# EAGLE design ver9 (EAGLE 6.4)
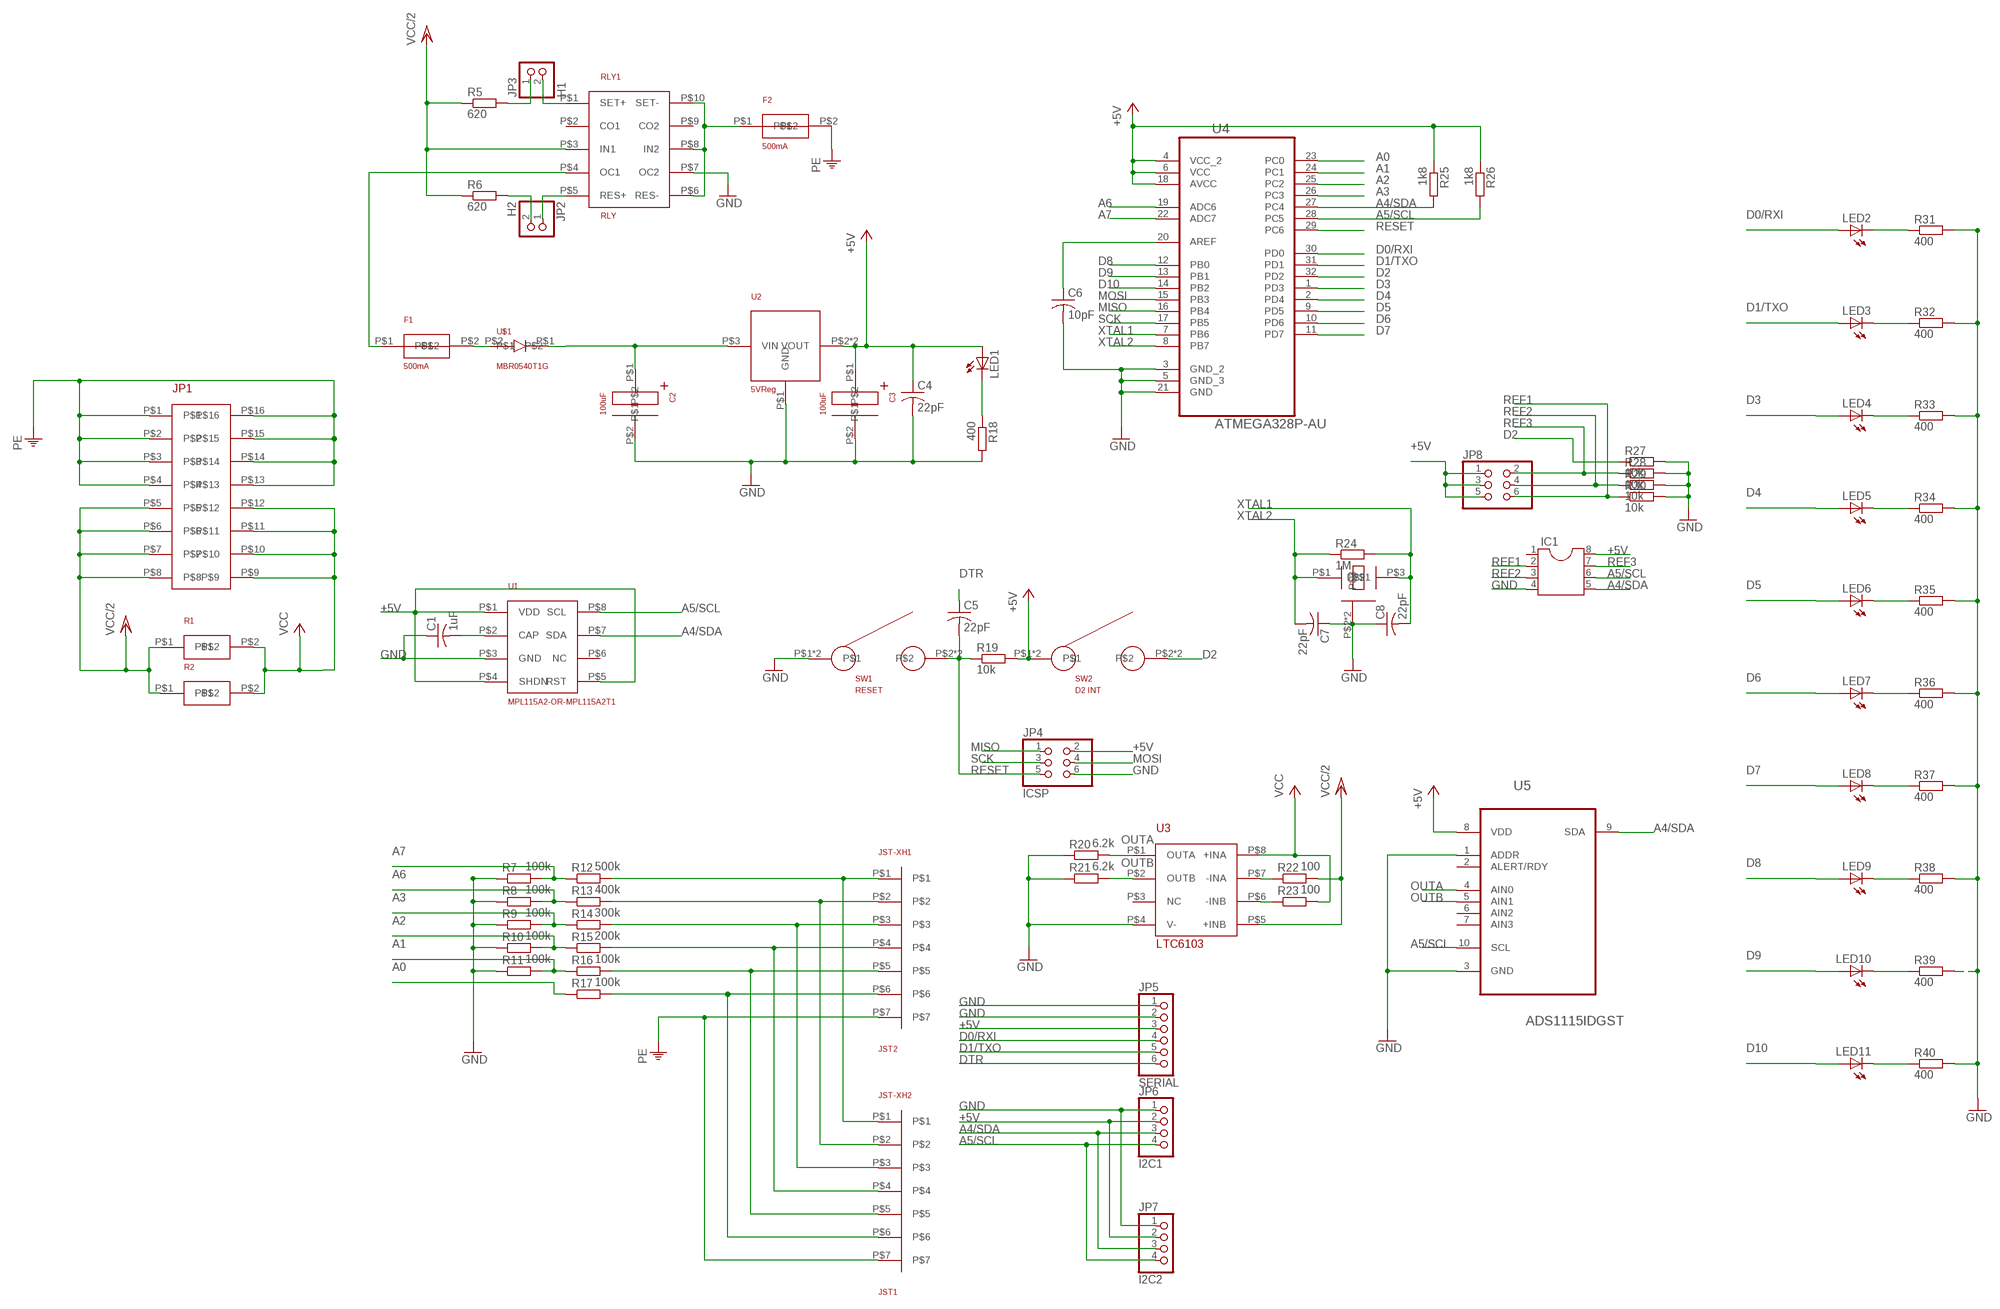
[diagram p0: schematic, sheet 1]

## Parts
C1  1uF  C-USC1206  [C1206]
C2  100uF  EEEFTH101XAP  [EEEFTH101XAP]
C3  100uF  EEEFTH101XAP  [EEEFTH101XAP]
C4  22pF  C-USC1206  [C1206]
C5  22pF  C-USC1206  [C1206]
C6  10pF  C-USC1206  [C1206]
C7  22pF  C-USC1206  [C1206]
C8  22pF  C-USC1206  [C1206]
F1  500mA  MF-MSMF050-2  [MF-MSMF050-2]
F2  500mA  0154.500DR-FUSE-0453.500  [0154.500DR-FUSE-0453.500]
IC1  DIL8S  [SOCKET-08]
JP1  39-29-1167-MOLEX  [39-29-1167-MOLEX]
JP2  H2  PINHD-1X2  [1X02]
JP3  H1  PINHD-1X2  [1X02]
JP4  ICSP  PINHD-2X3  [2X03]
JP5  SERIAL  PINHD-1X6  [1X06]
JP6  I2C1  PINHD-1X4  [1X04]
JP7  I2C2  PINHD-1X4  [1X04]
JP8  PINHD-2X3  [2X03]
JST-XH1  JST2  JSTXH-7PIN  [JSTXH-7PIN]
JST-XH2  JST1  JSTXH-7PIN  [JSTXH-7PIN]
LED1  LED1206  [LED-1206]
LED2  LED1206  [LED-1206]
LED3  LED1206  [LED-1206]
LED4  LED1206  [LED-1206]
LED5  LED1206  [LED-1206]
LED6  LED1206  [LED-1206]
LED7  LED1206  [LED-1206]
LED8  LED1206  [LED-1206]
LED9  LED1206  [LED-1206]
LED10  LED1206  [LED-1206]
LED11  LED1206  [LED-1206]
R1  OARSXPR002FLF  [OARSXPR002FLF]
R2  OARSXPR002FLF  [OARSXPR002FLF]
R5  620  R-EU_R1206  [R1206]
R6  620  R-EU_R1206  [R1206]
R7  100k  R-EU_R1206  [R1206]
R8  100k  R-EU_R1206  [R1206]
R9  100k  R-EU_R1206  [R1206]
R10  100k  R-EU_R1206  [R1206]
R11  100k  R-EU_R1206  [R1206]
R12  500k  R-EU_R1206  [R1206]
R13  400k  R-EU_R1206  [R1206]
R14  300k  R-EU_R1206  [R1206]
R15  200k  R-EU_R1206  [R1206]
R16  100k  R-EU_R1206  [R1206]
R17  100k  R-EU_R1206  [R1206]
R18  400  R-EU_R1206  [R1206]
R19  10k  R-EU_R1206  [R1206]
R20  6.2k  R-EU_R1206  [R1206]
R21  6.2k  R-EU_R1206  [R1206]
R22  100  R-EU_R1206  [R1206]
R23  100  R-EU_R1206  [R1206]
R24  1M  R-EU_R1206  [R1206]
R25  1k8  R-EU_R1206  [R1206]
R26  1k8  R-EU_R1206  [R1206]
R27  10k  R-EU_R1206  [R1206]
R28  10k  R-EU_R1206  [R1206]
R29  10k  R-EU_R1206  [R1206]
R30  10k  R-EU_R1206  [R1206]
R31  400  R-EU_R1206  [R1206]
R32  400  R-EU_R1206  [R1206]
R33  400  R-EU_R1206  [R1206]
R34  400  R-EU_R1206  [R1206]
R35  400  R-EU_R1206  [R1206]
R36  400  R-EU_R1206  [R1206]
R37  400  R-EU_R1206  [R1206]
R38  400  R-EU_R1206  [R1206]
R39  400  R-EU_R1206  [R1206]
R40  400  R-EU_R1206  [R1206]
RLY1  RLY  3-1393788-3  [3-1393788-3]
SW1  RESET  MC32829  [MC32829]
SW2  D2 INT  MC32829  [MC32829]
U1  MPL115A2-OR-MPL115A2T1  [MPL115A2-OR-MPL115A2T1]
U2  5VReg  NX1117C50Z  [NX1117C50Z]
U3  LTC6103  LTC6103CMS8#PBF  [LTC6103CMS8#PBF]
U4  ATMEGA328P-AU  [QFP80P900X900X120-32N]
U5  ADS1115IDGST  [SOP50P490X110-10N]
U$1  MBR0540T1G  [MBR0540T1G]
XT1  ABMM2-16.000MHZ-E2-T  [ABMM2-16.000MHZ-E2-T]

## Nets
+5V: C3.P$1 C4.1 IC1.8 JP4.2 JP5.3 JP6.2 JP7.2 JP8.1 JP8.3 JP8.5 LED1.A R19.2 R25.1 R26.1 SW2.P$1 SW2.P$4 U1.P$1(VDD) U1.P$4(SHDN) U1.P$5(RST) U2.P$2(VOUT) U2.P$4(VOUT) U4.4(VCC_2) U4.6(VCC) U4.18(AVCC) U5.8(VDD)
A0: R17.1 U4.23(PC0)
A1: R11.2 R16.1 U4.24(PC1)
A2: R10.2 R15.1 U4.25(PC2)
A3: R9.2 R14.1 U4.26(PC3)
A4/SDA: IC1.5 JP6.3 JP7.3 R25.2 U1.P$7(SDA) U4.27(PC4) U5.9(SDA)
A5/SCL: IC1.6 JP6.4 JP7.4 R26.2 U1.P$8(SCL) U4.28(PC5) U5.10(SCL)
A6: R8.2 R13.1 U4.19(ADC6)
A7: R7.2 R12.1 U4.22(ADC7)
D0/RXI: JP5.4 LED2.A U4.30(PD0)
D1/TXO: JP5.5 LED3.A U4.31(PD1)
D2: R27.1 SW2.P$2 SW2.P$3 U4.32(PD2)
D3: LED4.A U4.1(PD3)
D4: LED5.A U4.2(PD4)
D5: LED6.A U4.9(PD5)
D6: LED7.A U4.10(PD6)
D7: LED8.A U4.11(PD7)
D8: LED9.A U4.12(PB0)
D9: LED10.A U4.13(PB1)
D10: LED11.A U4.14(PB2)
DTR: C5.1 JP5.6
GND: C1.1 C2.P$2 C3.P$2 C4.2 C6.2 C7.1 C8.1 IC1.4 JP4.6 JP5.1 JP5.2 JP6.1 JP7.1 R7.1 R8.1 R9.1 R10.1 R11.1 R18.2 R20.1 R21.1 R27.2 R28.2 R29.2 R30.2 R31.2 R32.2 R33.2 R34.2 R35.2 R36.2 R37.2 R38.2 R39.2 R40.2 RLY1.P$7(OC2) SW1.P$1 SW1.P$4 U1.P$3(GND) U2.P$1(GND) U3.P$4(V-) U4.3(GND_2) U4.5(GND_3) U4.21(GND) U5.1(ADDR) U5.3(GND) XT1.P$2 XT1.P$4
MISO: JP4.1 U4.16(PB4)
MOSI: JP4.4 U4.15(PB3)
N$1: F1.P$1 RLY1.P$4(OC1)
N$2: C2.P$1 U2.P$3(VIN) U$1.P$1
N$3: F1.P$2 U$1.P$2
N$4: LED1.C R18.1
N$5: JP3.1 R5.2
N$6: JP3.2 RLY1.P$1(SET+)
N$7: LED2.C R31.1
N$9: LED3.C R32.1
N$10: LED4.C R33.1
N$11: LED5.C R34.1
N$12: LED6.C R35.1
N$13: LED7.C R36.1
N$14: LED8.C R37.1
N$15: LED9.C R38.1
N$16: LED10.C R39.1
N$17: LED11.C R40.1
N$18: JST-XH1.P$1 JST-XH2.P$1 R12.2
N$19: JST-XH1.P$2 JST-XH2.P$2 R13.2
N$20: JST-XH1.P$3 JST-XH2.P$3 R14.2
N$21: JST-XH1.P$4 JST-XH2.P$4 R15.2
N$22: JST-XH1.P$5 JST-XH2.P$5 R16.2
N$23: JST-XH1.P$6 JST-XH2.P$6 R17.2
N$24: JP2.2 R6.2
N$25: C6.1 U4.20(AREF)
N$26: F2.P$1 RLY1.P$6(RES-) RLY1.P$8(IN2) RLY1.P$10(SET-)
N$27: JP2.1 RLY1.P$5(RES+)
N$29: R22.1 U3.P$7(-INA)
N$30: R23.1 U3.P$6(-INB)
N$32: C1.2 U1.P$2(CAP)
OUTA: R20.2 U3.P$1(OUTA) U5.4(AIN0)
OUTB: R21.2 U3.P$2(OUTB) U5.5(AIN1)
PE: F2.P$2 JP1.P$1 JP1.P$2 JP1.P$3 JP1.P$4 JP1.P$13 JP1.P$14 JP1.P$15 JP1.P$16 JST-XH1.P$7 JST-XH2.P$7
REF1: IC1.2 JP8.6 R30.1
REF2: IC1.3 JP8.4 R29.1
REF3: IC1.7 JP8.2 R28.1
RESET: C5.2 JP4.5 R19.1 SW1.P$2 SW1.P$3 U4.29(PC6)
SCK: JP4.3 U4.17(PB5)
VCC: JP1.P$9 JP1.P$10 JP1.P$11 JP1.P$12 R1.P$2 R2.P$2 R23.2 U3.P$8(+INA)
VCC/2: JP1.P$5 JP1.P$6 JP1.P$7 JP1.P$8 R1.P$1 R2.P$1 R5.1 R6.1 R22.2 RLY1.P$3(IN1) U3.P$5(+INB)
XTAL1: C8.2 R24.2 U4.7(PB6) XT1.P$3
XTAL2: C7.2 R24.1 U4.8(PB7) XT1.P$1
Unconnected: IC1.1 RLY1.P$2(CO1) RLY1.P$9(CO2) U1.P$6(NC) U3.P$3(NC) U5.2(ALERT/RDY) U5.6(AIN2) U5.7(AIN3)

## Library data of the parts
C1 C4-C8 = resistor:C-US: CAPACITOR, American symbol
C2 C3 = ver5:EEEFTH101XAP
F1 = ver4:MF-MSMF050-2
F2 = ver5:0154.500DR-FUSE-0453.500
IC1 = ic-package:DIL8: Dual In Line / Socket
JP1 = ver4:39-29-1167-MOLEX
JP2 JP3 = pinhead:PINHD-1X2: PIN HEADER
JP4 JP8 = pinhead:PINHD-2X3: PIN HEADER
JP5 = pinhead:PINHD-1X6: PIN HEADER
JP6 JP7 = pinhead:PINHD-1X4: PIN HEADER
JST-XH1 JST-XH2 = ver4:JSTXH-7PIN: Just a 7 Pin connector for JST Purposes
LED1-LED11 = SparkFun-LED:LED: LEDs Standard schematic elements and footprints for 5mm, 3mm, 1206, and 0603 sized LEDs. 5mm - Spark Fun Electronics SKU : COM-00529 (and others)
R1 R2 = ver5:OARSXPR002FLF
R5-R40 = resistor:R-EU_: RESISTOR, European symbol
RLY1 = ver4:3-1393788-3
SW1 SW2 = ver4:MC32829
U1 = ver5:MPL115A2-OR-MPL115A2T1
U2 = ver4:NX1117C50Z
U3 = ver4:LTC6103CMS8#PBF
U4 = Atmel_By_element14_Batch_1:ATMEGA328P-AU: 8-bit Microcontroller with In-System Programmable Flash; MPN: ATMEGA328P-AU; OC_FARNELL: 1715486; OC_NEWARK: 14R4631; PACKAGE: TQFP-32; SUPPLIER: Atmel
U5 = bbauv:ADS1115IDGST: Analog-to-Digital Converter with Internal Reference; MPN: ADS1115IDGST; OC_FARNELL: 1762981; OC_NEWARK: 25R1241; PACKAGE: MSOP-10; SUPPLIER: Texas Instruments
U$1 = ver4:MBR0540T1G
XT1 = ver5:ABMM2-16.000MHZ-E2-T

## Net classes
0 default: width 0.254 mm, clearance 0.508 mm

## Board
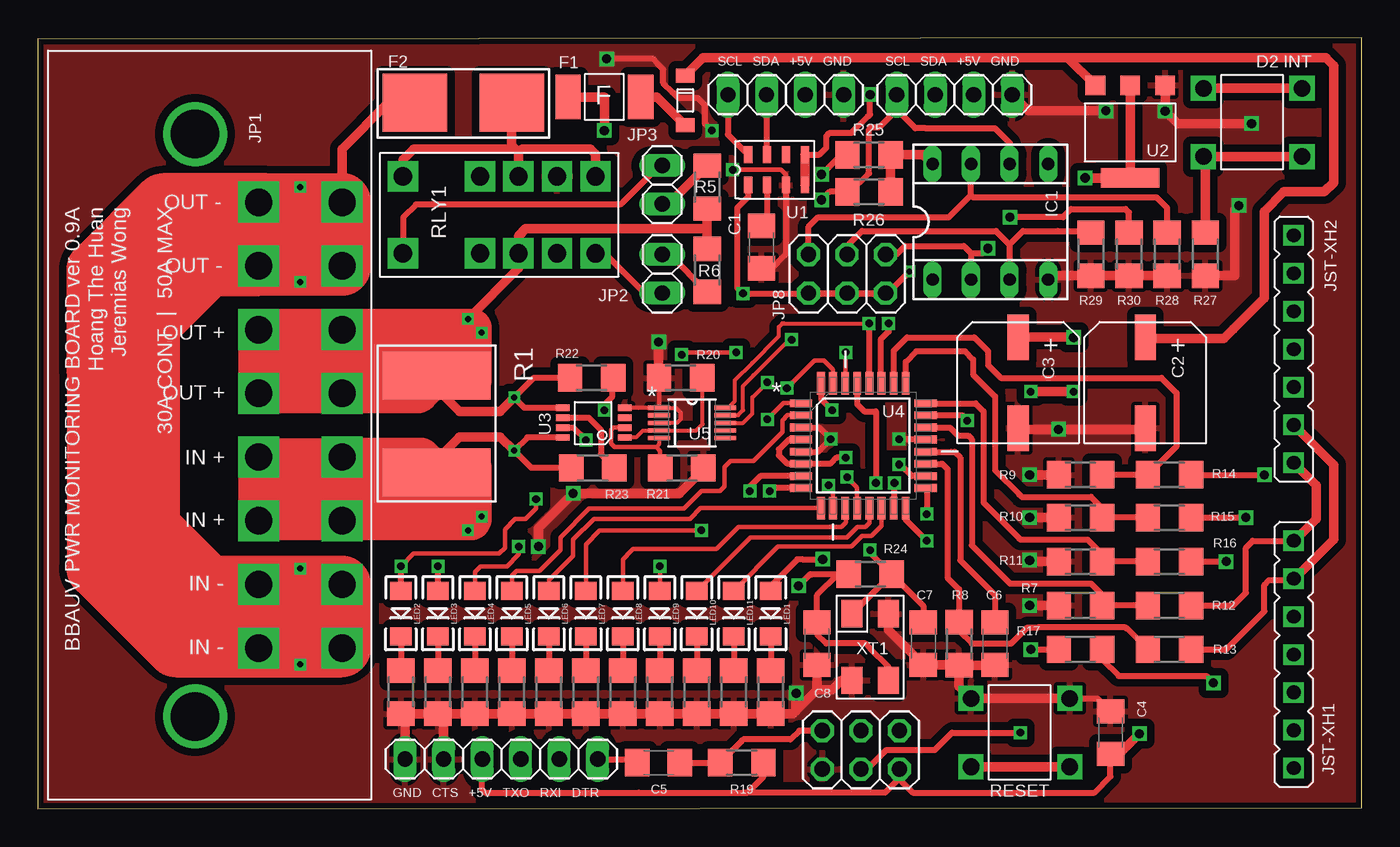
[diagram p1: board, top side]
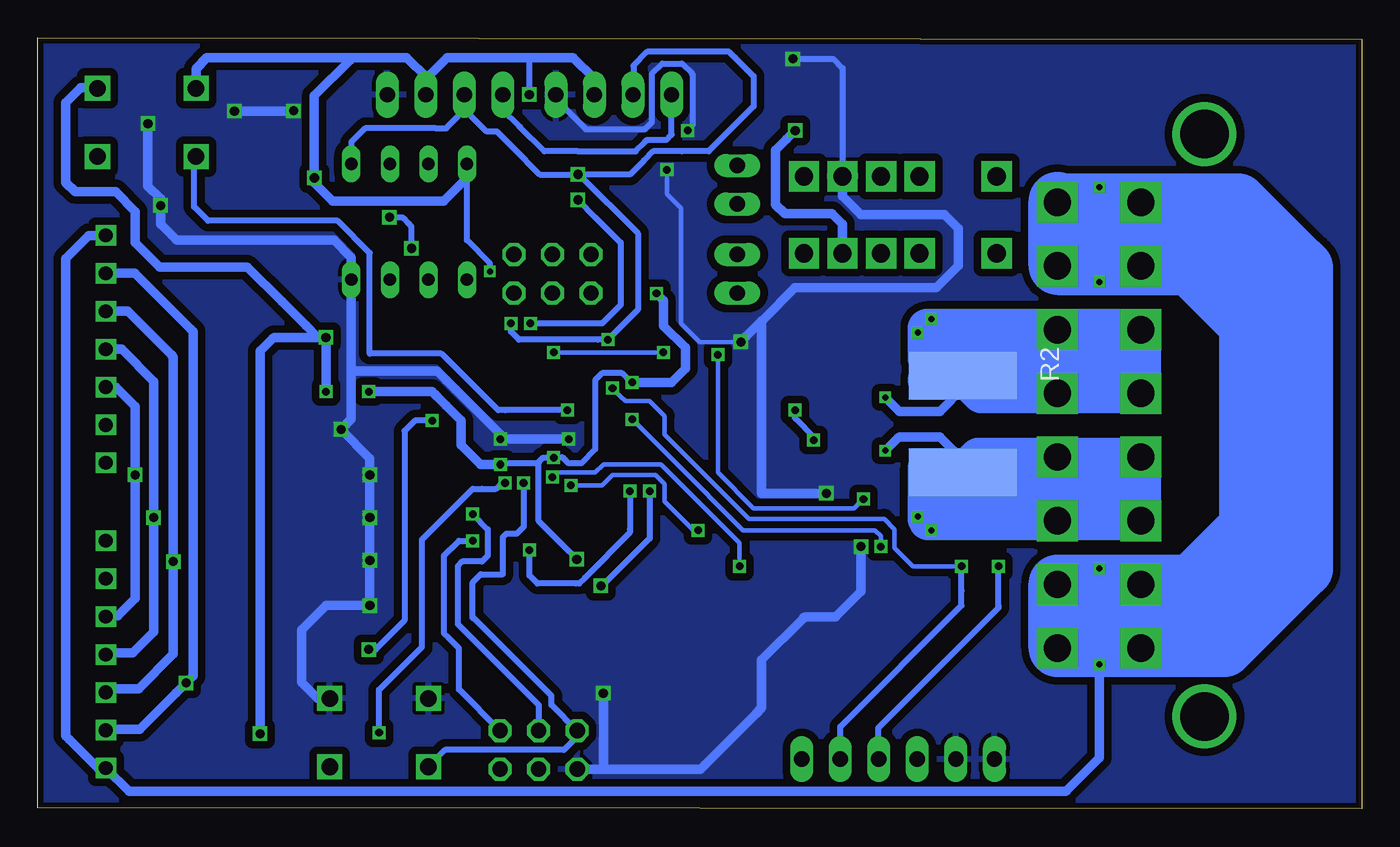
[diagram p2: board, bottom side, seen from below]

Size 87.26 x 50.84 mm. Coordinates in mm from the lower left corner, seen from the top.
Outline: 0,0 87.26,0.08 87.26,50.84 0,50.76 0,0
Copper layers (1*16): Top 0.0356mm / dielectric 1.5011mm / Bottom 0.0356mm
Design rules "LaenPCBOrder": minimum track width 6mil, minimum drill 13mil, track to track 6mil, track to pad 6mil, pad to pad 6mil, via to via 6mil, smd to smd 6mil, copper to edge 15mil, drill to drill 6mil, minimum pad ring 7mil, minimum via ring 7mil, stop-mask expansion 3mil, vias tented up to drill 0mil, thermal gap 10mil

### Footprints (pad centres in the part's own frame; a part is rotated, then mirrored left to right if it is on the bottom)
C1206 = smd 1.6 x 1.8: 1 -1.4,0; 2 1.4,0
EEEFTH101XAP = smd 3 x 1.4: P$1 -1,0; P$2 5,0
MF-MSMF050-2 = smd 1.68 x 2.95: P$1 -2.39,0; P$2 2.39,0
0154.500DR-FUSE-0453.500 = smd 4.24 x 3.81: P$1 -3.19,0; P$2 3.19,0
SOCKET-08 = drill 0.813 long: 1 -3.81,-3.81; 2 -1.27,-3.81; 3 1.27,-3.81; 4 3.81,-3.81; 5 3.81,3.81; 6 1.27,3.81; 7 -1.27,3.81; 8 -3.81,3.81
39-29-1167-MOLEX = drill 1.8 square: P$1 -14.7,5.5; P$2 -14.7,0; P$3 -10.5,5.5; P$4 -10.5,0; P$5 -6.3,5.5; P$6 -6.3,0; P$7 -2.1,5.5; P$8 -2.1,0; P$9 2.1,5.5; P$10 2.1,0; P$11 6.3,5.5; P$12 6.3,0; P$13 10.5,5.5; P$14 10.5,0; P$15 14.7,5.5; P$16 14.7,0 | drill 3.2 pad 4.2: P$17 -19.2,-4.2; P$18 19.2,-4.2
1X02 = drill 1.016 long: 1 -1.27,0; 2 1.27,0
2X03 = drill 1.016 octagon: 1 -2.54,-1.27; 2 -2.54,1.27; 3 0,-1.27; 4 0,1.27; 5 2.54,-1.27; 6 2.54,1.27
1X06 = drill 1.016 long: 1 -6.35,0; 2 -3.81,0; 3 -1.27,0; 4 1.27,0; 5 3.81,0; 6 6.35,0
1X04 = drill 1.016 long: 1 -3.81,0; 2 -1.27,0; 3 1.27,0; 4 3.81,0
JSTXH-7PIN = drill 0.9 square: P$1 0,0; P$2 2.5,0; P$3 5,0; P$4 7.5,0; P$5 10,0; P$6 12.5,0; P$7 15,0
LED-1206 = smd 1.2 x 1.4: A -1.5,0; C 1.5,0
OARSXPR002FLF = smd 3.18 x 7.11: P$1 -3.2,0; P$2 3.2,0
R1206 = smd 1.6 x 1.803: 1 -1.422,0; 2 1.422,0
3-1393788-3 = drill 1.2 pad 2 square: P$1 0,-2.54; P$2 5.08,-2.54; P$3 7.62,-2.54; P$4 10.16,-2.54; P$5 12.7,-2.54; P$6 12.7,2.54; P$7 10.16,2.54; P$8 7.62,2.54; P$9 5.08,2.54; P$10 0,2.54
MC32829 = drill 1.1 square: P$1 -3.25,-2.25; P$2 -3.25,2.25; P$3 3.25,2.25; P$4 3.25,-2.25
MPL115A2-OR-MPL115A2T1 = smd 1.1 x 0.55: P$1 -1,1.875; P$2 -1,0.625; P$3 -1,-0.625; P$4 -1,-1.875; P$5 1,-1.875; P$6 1,-0.625; P$7 1,0.625; P$8 1,1.875
NX1117C50Z = smd 1.3 x 1.3: P$1 -2.3,0; P$2 0,0; P$3 2.3,0 | smd 3.85 x 1.3: P$4 0,6.1
LTC6103CMS8#PBF = smd 0.889 x 0.42: P$1 -4.089,1.95; P$2 -4.089,1.3; P$3 -4.089,0.65; P$4 -4.089,0; P$5 0,0; P$6 0,0.65; P$7 0,1.3; P$8 0,1.95
QFP80P900X900X120-32N = smd 1.473 x 0.508: 1 -4.115,2.794; 2 -4.115,2.007; 3 -4.115,1.194; 4 -4.115,0.406; 5 -4.115,-0.406; 6 -4.115,-1.194; 7 -4.115,-2.007; 8 -4.115,-2.794; 17 4.115,-2.794; 18 4.115,-2.007; 19 4.115,-1.194; 20 4.115,-0.406; 21 4.115,0.406; 22 4.115,1.194; 23 4.115,2.007; 24 4.115,2.794 | smd 0.508 x 1.473: 9 -2.794,-4.115; 10 -2.007,-4.115; 11 -1.194,-4.115; 12 -0.406,-4.115; 13 0.406,-4.115; 14 1.194,-4.115; 15 2.007,-4.115; 16 2.794,-4.115; 25 2.794,4.115; 26 2.007,4.115; 27 1.194,4.115; 28 0.406,4.115; 29 -0.406,4.115; 30 -1.194,4.115; 31 -2.007,4.115; 32 -2.794,4.115
SOP50P490X110-10N = smd 1.422 x 0.279: 1 -2.184,0.991; 2 -2.184,0.508; 3 -2.184,0; 4 -2.184,-0.508; 5 -2.184,-0.991; 6 2.184,-0.991; 7 2.184,-0.508; 8 2.184,0; 9 2.184,0.508; 10 2.184,0.991
MBR0540T1G@1 = smd 0.91 x 1.22: P$1 1.635,0; P$2 -1.635,0
ABMM2-16.000MHZ-E2-T = smd 1.8 x 1.4: P$1 -2.2,-1.2; P$2 2.2,-1.2; P$3 2.2,1.2; P$4 -2.2,1.2

### Placement (x,y rotation side)
C1  47.7,37.03 90 top
C2  73,30.1 270 top
C3  64.62,30.1 270 top
C4  70.71,5.03 90 top
C5  40.92,3.05 0 top
C6  63.09,10.9 270 top
C7  58.37,10.9 90 top
C8  51.36,10.9 90 top
F1  37.34,46.94 0 top
F2  28.04,46.56 180 top
IC1  62.79,38.71 0 top
JP1  14.55,25.3 270 top
JP2  41.15,35.28 90 top
JP3  41.15,41.15 90 top
JP4  54.25,3.89 180 top
JP5  30.56,3.28 0 top
JP6  49.3,47.09 180 top
JP7  60.43,47.09 180 top
JP8  53.34,35.28 0 top
JST-XH1  82.79,17.68 270 top
JST-XH2  82.79,22.81 90 top
LED1  48.31,12.88 270 top
LED2  23.93,12.88 270 top
LED3  26.37,12.88 270 top
LED4  28.8,12.88 270 top
LED5  31.24,12.88 270 top
LED6  33.68,12.88 270 top
LED7  36.12,12.88 270 top
LED8  38.56,12.88 270 top
LED9  41,12.88 270 top
LED10  43.43,12.88 270 top
LED11  45.87,12.88 270 top
R1  26.29,25.37 270 top
R2  26.29,25.37 270 bottom
R5  44.12,41 90 top
R6  44.12,35.51 270 top
R7  68.73,13.41 0 top
R8  60.73,10.9 90 top
R9  68.73,22.02 0 top
R10  68.73,19.2 0 top
R11  68.73,16.31 0 top
R12  74.6,13.41 0 top
R13  74.6,10.52 0 top
R14  74.6,22.02 0 top
R15  74.6,19.2 0 top
R16  74.6,16.31 0 top
R17  68.73,10.52 0 top
R18  48.31,7.7 270 top
R19  46.41,3.05 0 top
R20  42.37,28.42 0 top
R21  42.44,22.48 180 top
R22  36.5,28.42 180 top
R23  36.58,22.48 180 top
R24  54.86,15.47 180 top
R25  54.79,43.13 180 top
R26  54.79,40.69 180 top
R27  76.96,36.58 270 top
R28  74.45,36.58 270 top
R29  69.42,36.58 270 top
R30  71.93,36.58 270 top
R31  23.93,7.7 270 top
R32  26.37,7.7 270 top
R33  28.8,7.7 270 top
R34  31.24,7.7 270 top
R35  33.68,7.7 270 top
R36  36.12,7.7 270 top
R37  38.56,7.7 270 top
R38  41,7.7 270 top
R39  43.43,7.7 270 top
R40  45.87,7.7 270 top
RLY1  24.06,39.16 0 top
SW1  64.77,5.03 180 top
SW2  80.09,45.26 180 top
U1  48.69,42.14 90 top
U2  72.01,47.7 180 top
U3  34.59,26.44 180 top
U4  54.42,23.95 0 top
U5  43.13,25.45 0 top
U$1  MBR0540T1G  [MBR0540T1G@1]  42.67,46.71 90 top
XT1  54.86,10.67 270 top

### Tracks (layer width: path | path; a pad name or v marks a point on that pad's centre or on a via)
+5V  (via drill 0.4, 0.5, 0.6)
  Top 0.254: U5.8 46.48,25.45 47.09,26.06 47.09,27.13 v48.08,28.12
  Top 0.406: 46.82,40.34 U1.P$1 46.82,40.34 | 46.82,40.34 46.1,39.62 | 46.1,39.62 46.1,34.37 | 46.1,34.37 v46.48,33.98 | v46.48,33.98 50.09,33.98 50.77,33.98 JP8.1 JP8.3 JP8.5 | JP5.3 29.26,3.25 29.26,1.3 29.49,1.07 39.62,1.07 46.48,1.07 | 46.48,1.07 46.79,1.07 47.83,2.11 R19.2 | 46.48,1.07 55.85,1.07 55.93,1.14 56.77,1.98 | 56.77,1.98 56.77,2.59 JP4.2 | 56.77,1.98 57.68,1.07 69.65,1.07 70.71,2.13 C4.1 70.82,3.73 71.04,3.73 | U4.4 49.5,24.35 48.84,23.7 48.84,23.32 49.38,22.78 50.27,22.78 U4.6 50.3,22.78 52.27,22.78 52.65,23.16 v53.26,23.16 | v51.74,16.46 50.39,16.46 50.06,16.46 48.31,14.71 LED1.A | U4.18 | 46.82,40.34 46.1,39.62 | 46.1,39.62 46.1,34.37 | 46.1,34.37 v46.48,33.98 | v46.48,33.98 56.01,33.98 v57.45,35.43 | U1.P$5 51.52,43.14 51.97,43.59 51.97,44.35 52.2,44.58 53.64,44.58 54.71,45.64 54.79,45.72 54.86,45.8 v54.86,47.09 | U4.18 57.61,21.95 56.84,22.71 v56.77,22.71
  Top 0.61: U1.P$5 U1.P$4 | R26.1 R25.1 58.37,43.13 IC1.8 | SW2.P$4 SW2.P$1 | U2.P$2 U2.P$4 v69.04,41.6 | C3.P$1 v68.27,31.1 v68.27,31.09 | 71.04,3.73 71.4,3.73 v72.62,4.95 | v65.46,27.51 68.12,27.51 68.2,27.51 v68.27,27.51
  Bottom 0.254: v48.08,28.12 48.16,28.12
  Bottom 0.406: v51.74,16.46 52.27,16.99 54.25,18.97 54.25,22.78 | 54.25,22.78 56.77,22.78 | v57.45,35.43 57.45,35.97 58.98,37.49 58.98,41.6 | v54.86,47.09 54.86,49.45 54.79,49.53 | v48.08,28.12 48.16,28.12 48.77,28.73 50.06,28.73 50.52,28.27 50.52,23.7 51.43,22.78 52.27,22.78 52.5,23.01 52.65,23.16 v53.26,23.16 53.95,23.16 54.25,22.86 54.25,22.78
  Bottom 0.61: JP6.2 50.57,48.13 51.97,49.53 54.79,49.53 60.27,49.53 61.61,48.2 | 61.61,48.2 61.65,48.16 61.65,47.14 JP7.2 | IC1.8 58.98,41.6 60.5,40.08 67.82,40.08 69.04,41.3 | 69.04,41.3 v69.04,41.6 | v69.04,41.6 69.04,41.99 | 69.04,41.99 69.04,44.58 | 69.04,44.58 69.04,47.02 66.67,49.38 66.52,49.53 66.29,49.53 | SW2.P$1 83.37,47.55 84.43,47.55 85.42,46.56 85.42,41.3 84.81,40.69 82.14,40.69 80.85,39.4 80.85,37.34 79.25,35.74 73.46,35.74 71.17,33.45 69.58,31.86 68.81,31.09 v68.27,31.09 | 69.04,41.3 v69.04,41.6 | v69.04,41.6 69.04,41.99 | 69.04,41.99 69.04,44.58 | 61.61,48.2 62.94,49.53 66.29,49.53 | SW2.P$4 76.84,48.82 76.12,49.53 66.29,49.53 | v69.04,41.6 69.04,41.99 | v46.48,33.98 46.02,33.53 46.02,31.85 44.58,30.4 44.58,29.03 45.49,28.12 v48.08,28.12 | v72.62,4.95 72.62,30.17 71.78,31.01 71.7,31.09 v68.27,31.09 | v56.77,22.71 58.06,22.71 59.36,24 59.36,25.6 60.35,26.59 60.96,27.2 61.04,27.28 61.11,27.36 61.26,27.51 v65.46,27.51 | v68.27,27.51 v68.27,31.09
A0  (via drill 0.5, 0.6)
  Top 0.406: U4.23 60.91,25.95 v61.26,25.6 | v65.46,10.52 R17.1
  Bottom 0.406: v61.26,25.6 62.41,25.6 63.09,24.92 63.09,12.42 65,10.52 v65.46,10.52
A1
  Top 0.406: R16.1 R11.2 70.1,16.36 70.1,16.84 69.19,17.75 64.77,17.75 64.69,17.83 62.33,20.19 62.33,21.03 62.33,26.21 61.8,26.74 U4.24
A2
  Top 0.406: R15.1 R10.2 70.1,19.25 70.1,19.89 69.42,20.57 64.85,20.57 64.77,20.65 64.69,20.73 63.09,22.33 63.09,27.2 61.65,28.65 61.65,29.64 61.11,30.17 57.91,30.17 57.21,29.47 U4.25
A3
  Top 0.406: R9.2 R14.1 75.06,23.9 75.06,27.43 74.07,28.42 63.47,28.42 62.64,29.26 62.64,30.17 61.72,31.09 57.3,31.09 56.42,30.21 U4.26
A4/SDA  (via drill 0.5, 0.6)
  Top 0.254: v49.68,30.94 49.63,30.94 arc45 49.46,30.86 47.17,28.57 46.48,27.89 46.48,26.29 46.15,25.96 U5.9
  Top 0.406: JP6.3 48.03,43.17 U1.P$7 | R25.2 52.96,43.13 v51.66,41.83 | v56.08,32 56.08,31.47 55.55,30.94 55.55,28.12 U4.27
  Bottom 0.305: v49.68,30.94 50.37,30.94
  Bottom 0.406: JP7.3 59.16,46.81 | JP6.3 48.01,47.12 48.01,48.16 48.01,49 47.09,49.91 41.68,49.91 41.6,49.83 41.3,49.53 40.08,48.31 40.08,46.33 43.05,43.36 44.81,43.36 46.71,43.36 47.32,42.75 48.23,41.83 v51.66,41.83 | JP7.3 59.16,46.76 | IC1.5 66.6,43.97 65.68,44.88 61.04,44.88 60.35,44.88 59.13,46.1 | v51.66,41.83 51.59,41.83 47.7,37.95 47.7,32.92 v49.68,30.94 50.37,30.94 55.55,30.94 56.08,31.47 56.08,31.93 v56.08,32 | v51.66,41.83 54.18,41.83 55.93,43.59 57,44.65 57.68,44.65 59.13,46.1 | 59.13,46.1 59.13,47.07 JP7.3
A5/SCL  (via drill 0.5, 0.6)
  Top 0.254: v54.79,32 49.18,32 49.07,32 48.84,31.78 48.84,31.27 48.84,31.17 48.77,31.09 | 48.77,31.09 | U5.10 45.49,26.44 45.95,26.9 45.95,28.27 47.09,29.41 48.77,31.09
  Top 0.406: JP6.4 45.49,44.46 U1.P$8 | IC1.6 64.08,42.54 64.08,43.89 64.01,43.97 63.09,44.88 58.52,44.88 57.84,44.88 56.62,46.1 | 56.62,46.1 JP7.4 | R26.2 53.57,40.69 | 53.57,40.69 54.71,41.83 54.79,41.91 54.79,44.81 54.94,44.96 55.47,44.96 56.24,45.72 56.62,46.1 | 53.57,40.69 52.2,40.69 51.74,40.23 v51.66,40.16 | v54.79,32 54.79,28.1 U4.28
  Bottom 0.406: 45.49,45.8 JP6.4 45.49,44.46 45.55,44.41 45.84,44.12 47.09,44.12 47.17,44.04 47.24,43.97 47.85,43.36 51.66,43.36 53.87,43.36 55.47,44.96 55.55,45.03 56.62,46.1 JP7.4 | v51.66,40.16 50.52,39.01 48.84,37.34 48.84,33.22 50.06,32 54.25,32 v54.79,32
A6
  Top 0.406: R13.1 73.15,10.52 71.78,11.89 71.7,11.96 65.91,11.96 65.23,11.96 64.16,10.9 61.57,10.9 60.73,11.73 R8.2 60.73,14.48 59.97,15.24 59.97,22.4 59.62,22.75 59.54,22.75 U4.19
A7
  Top 0.406: R12.1 R7.2 70.18,13.44 70.18,14.1 69.42,14.86 64.08,14.86 64.01,14.93 63.86,15.09 61.57,17.37 61.57,24.38 61.34,24.61 60.65,24.61 60.13,25.14 U4.22
D0/RXI  (via drill 0.5)
  Top 0.305: v46.02,30.1 42.6,30.1 v42.44,29.95 | U4.30 53.22,30.06 v53.26,30.1 | v32.84,20.42 32.84,19.81 32.16,19.13 31.47,19.13 30.78,18.44 30.78,17.22 30.4,16.84 24.76,16.84 v23.93,16
  Top 0.406: LED2.A v23.93,16
  Bottom 0.305: 52.81,30.1 v53.26,30.1 52.81,30.1 | 52.81,30.1 v46.02,30.1 | v42.44,29.95 42.44,22.17 40.08,19.81 33.45,19.81 v32.84,20.42
  Bottom 0.406: JP5.4 31.85,3.3 31.85,5.33 23.93,13.26 23.93,13.41 v23.93,16
D1/TXO  (via drill 0.5)
  Top 0.305: U4.31 52.41,28.97 51.82,29.57 51.31,29.57 51.21,29.57 51.13,29.49 v49.38,27.74
  Top 0.406: LED3.A v26.36,16
  Bottom 0.305: v49.38,27.74 48.84,27.2 48.54,26.9 46.94,26.9 45.95,25.91 45.95,24.92 45.95,24.69 43.81,22.55 40.39,19.13 31.47,19.13 30.78,18.44 30.78,17.22 29.57,16 v26.36,16
  Bottom 0.406: JP5.5 34.37,5.41 26.36,13.41 LED3.A v26.36,16
D2  (via drill 0.5)
  Top 0.406: U4.32 51.62,27.02 v52.35,26.29
  Top 0.61: SW2.P$2 SW2.P$3 76.96,42.89 R27.1
  Bottom 0.406: v52.35,26.29 56.46,26.29 56.92,26.29 59.74,29.11 60.65,30.02 65.38,30.02 65.38,36.65 67.51,38.79 76.05,38.79 76.96,39.7 76.96,42.89 SW2.P$3
D3  (via drill 0.5)
  Top 0.305: U4.1 49.15,26.75 48.23,25.83 48.16,25.76 v48.08,25.68 | v31.7,17.3 31.7,16.76 30.94,16 29.18,16 28.8,15.62 LED4.A
  Bottom 0.305: v31.7,17.3 31.7,17.98 32.08,18.36 40.77,18.36 40.84,18.44 45.26,22.86 47.7,25.3 v48.08,25.68
D4
  Top 0.305: U4.2 49.42,25.95 49.07,25.6 49.07,24.84 47.17,22.94 45.72,22.94 45.64,22.94 45.26,22.55 45.26,21.26 44.96,20.95 43.74,20.95 42.6,19.81 36.35,19.81 34.44,17.91 34.44,17.07 33.07,15.7 31.55,15.7 31.24,15.39 LED5.A
D5
  Top 0.305: U4.9 43.68,19.83 42.98,19.13 36.65,19.13 35.28,17.75 35.28,16.69 34.75,16.15 33.68,15.09 LED6.A
D6  (via drill 0.5)
  Top 0.305: LED7.A 36.12,17.45 37.03,18.36 42.9,18.36 v43.74,18.36 | U4.10 52.41,21.2 52.27,21.34 v52.12,21.34
  Bottom 0.305: v43.74,18.36 44.04,18.36 45.95,20.27 45.95,21.41 46.1,21.56 46.56,22.02 49.38,22.02 49.83,21.56 50.06,21.34 v52.12,21.34
D7
  Top 0.305: LED8.A 38.56,16.46 39.09,16.99 39.24,17.14 44.73,17.14 46.18,18.59 52.96,18.59 53.26,18.9 53.26,19.79 U4.11
D8  (via drill 0.5)
  Top 0.305: U4.12 54.01,21.2 v53.34,21.87 | v41,16 LED9.A
  Bottom 0.305: v53.34,21.87 53.03,22.17 50.52,22.17 49.99,22.71 46.18,22.71 45.19,21.72 41,17.53 v41,16
D9
  Top 0.305: U4.13 54.82,18.86 54.56,18.59 54.03,18.59 53.34,17.91 46.96,17.91 LED10.A
D10
  Top 0.305: U4.14 55.61,18.65 54.94,17.98 54.33,17.98 53.87,17.53 53.64,17.3 48.79,17.3 LED11.A
DTR
  Top 0.406: JP5.6 39.29,3.28 arc-90 C5.1
GND  (via drill 0.5, 0.6)
  Top 0.254: U5.1 42.06,26.44 42.37,26.14 42.37,25.68 42.14,25.45 U5.3 | U5.1 U3.P$4 | R20.1 U5.1 | U5.1
  Top 0.305: 46.1,42.14 48.92,42.14 49,42.14 49.3,41.83 49.3,41.15 U1.P$3 | 46.1,42.14 v45.8,42.14 46.1,42.14
  Top 0.406: C1.1 48.36,35.63 49.22,36.5 49.32,36.59 U1.P$3 | U4.3 51.52,25.14 v52.27,24.38 51.43,23.54 U4.5 | U4.21 56.8,24.35 v56.77,24.38 | SW1.P$1 69.86,7.28 C4.2 | v44.42,44.73 44.12,45.03 43.97,45.19 43.97,46.41 43.51,46.86 42.21,46.86 41.83,47.24 41.22,47.85 41.22,48.77 40.84,49.15 40.54,49.45 v37.49,49.45
  Top 0.61: SW1.P$1 SW1.P$4 60.73,8.07 R8.1 | R9.1 v65.38,22.02 | R10.1 v65.38,19.2 | R7.1 v65.38,13.41 | R11.1 65.46,16.31 v65.38,16.38 | U2.P$1 v74.31,46.01 | v74.31,46.01 74.68,45.64 | 74.68,45.64 75.13,45.19 v80.01,45.19 | IC1.4 66.85,35.15 R29.2 R30.2 R28.2 | v67.28,25.02 66.67,25.02 | 66.67,25.02 64.69,25.02 C3.P$2 | v67.28,25.02 66.67,25.02 | R32.2 R31.2 24.21,5.99 JP5.1 | R32.2 R33.2 R34.2 R35.2 R36.2 R37.2 R38.2 | JP5.2 26.75,5.89 R32.2 | R38.2 R39.2 R40.2 R18.2 49.78,6.27 | 41,28.47 R20.1 40.92,28.45 v40.92,30.78 | R21.1 43.87,22.38 42.29,20.8 v35.28,20.8 32.99,18.52 v32.99,17.3 | 49.78,6.27 49.91,6.4 | 49.91,6.4 49.99,6.48 | 49.99,6.48 51.36,7.85 | 51.36,7.85 C8.1 | XT1.P$2 52.97,8.47 52.35,7.85 51.36,7.85 | XT1.P$4 56.06,11.8 C7.1 60.71,9.5 R8.1 | JP7.1 65.3,46.02 70.33,46.02 v70.41,46.02 | v74.31,46.01 74.68,45.64 | R8.1 63.07,9.47 C6.2 | R38.2 49.78,6.27 | 49.78,6.27 49.91,6.4 | 49.91,6.4 49.99,6.48 | 49.99,6.48 v49.99,7.62 | v67.28,25.02 72.92,25.02 C2.P$2 | R27.2 78.89,35.15 78.89,39.5 v79.17,39.78
  Bottom 0.305: v40.92,30.78 43.66,30.78 44.88,32 44.88,39.62 45.8,40.54 v45.8,42.14
  Bottom 0.406: v56.77,24.38 56.46,24.38 | JP6.1 53.11,46.79 51.13,44.81 47.24,44.81 46.79,45.26 46.79,48.46 46.1,49.15 44.81,49.15 44.12,48.46 44.12,45.03 v44.42,44.73 | v37.49,49.45 34.82,49.45 34.21,48.84 RLY1.P$7
  Bottom 0.61: 65.38,16.15 v65.38,13.41 68.27,13.41 69.88,11.81 69.88,8.35 68.81,7.28 SW1.P$1 | 65.38,16.15 65.38,16.31 | 65.38,16.61 v65.38,19.2 v65.38,22.02 65.38,23.12 v67.28,25.02 66.6,25.71 66.6,27.66 66.6,28.27 66.6,28.88 | 65.38,16.61 v65.38,16.38 | v65.38,16.38 65.38,16.15 | v65.38,16.38 65.38,16.61 | RLY1.P$7 34.22,40.39 32.99,39.17 27.51,39.17 26.59,38.25 26.59,35.81 28.04,34.37 37.34,34.37 39.47,32.23 | 39.47,32.23 39.55,32.16 | 39.55,32.16 40.54,31.17 v40.92,30.78 | 66.6,28.88 IC1.4 66.6,36.35 67.74,37.49 78.1,37.49 79.17,38.56 79.17,39.47 | 39.55,32.16 39.47,32.23 | JP4.6 49.99,2.62 | 49.99,2.62 43.59,2.62 43.28,2.92 39.93,6.27 39.55,6.65 39.55,9.83 36.8,12.57 arc45 36.62,12.65 34.67,12.65 32.99,14.33 v32.99,17.3 | v80.01,45.19 80.01,41.07 79.17,40.23 v79.17,39.78 | v52.27,24.38 56.46,24.38 v56.77,24.38 56.77,24.69 59.74,27.66 60.35,28.27 60.96,28.88 66.6,28.88 | v70.41,46.02 70.42,46.01 v74.31,46.01 | 36.58,20.8 35.97,20.8 | 35.97,20.8 v35.28,20.8 | v35.28,20.8 35.97,20.8 | 35.97,20.8 39.55,20.8 39.55,32.16 | v35.28,20.8 35.97,20.8 | v49.99,7.62 49.99,2.62 | 79.17,39.47 v79.17,39.78 | v79.17,39.78 79.17,39.47
  pour Top: -9.14,49.15 -9.14,51.28 -1.91,58.52 103.02,58.52 107.82,40.31 112.93,0.91 103.1,-8.92 2.74,-8.92 -7.85,1.68 -7.85,48.16 -8.69,49
  pour Bottom: -5.71,47.17 -5.71,47.78 0.53,54.03 101.57,55.63 105.23,41.61 108.43,1.3 102.49,-4.65 2.13,-4.65 -3.35,0.84 -3.35,42.14 -6.17,44.96
MISO  (via drill 0.5)
  Top 0.406: v58.6,17.68 57.21,19.07 U4.16
  Bottom 0.406: JP4.1 59.51,7.87 59.51,10.59 59.97,11.05 60.2,11.28 60.5,11.58 60.5,16.69 60.2,16.99 59.97,17.22 59.51,17.68 v58.6,17.68
MOSI  (via drill 0.5)
  Top 0.406: JP4.4 54.66,2.62 55.85,3.81 55.93,3.89 59.13,3.89 60.2,4.95 60.27,5.03 v64.77,5.03 | v56.46,21.49 56.42,21.45 U4.15
  Bottom 0.406: v64.77,5.03 64.77,7.85 61.95,10.67 61.95,17.75 58.6,21.11 57.99,21.11 57.07,21.11 56.69,21.49 v56.46,21.49
N$1  (via drill 0.6)
  Top 0.61: F1.P$1 37.34,46.94 v37.34,44.73
  Bottom 0.61: 37.91,44.16 v37.34,44.73 37.91,44.16 | 37.91,44.16 38.63,43.43 38.63,39.85 38.02,39.24 34.9,39.24 34.21,38.56 RLY1.P$4
N$2
  Top 0.61: U$1.P$1 43.86,49.53 46.86,49.53 67.59,49.53 | 67.59,49.53 67.88,49.53 U2.P$3 | 67.59,49.53 84.89,49.53 84.96,49.45 85.42,49 85.42,41.3 84.81,40.69 82.14,40.69 80.85,39.4 80.85,33.68 78.8,31.63 78.19,31.02 73.08,31.02 C2.P$1
N$3
  Top 0.61: F1.P$2 40.81,46.94 U$1.P$2
N$4
  Top 0.406: LED1.C R18.1
N$5
  Top 0.61: JP3.1 41.58,39.88 R5.2
N$6
  Top 0.406: RLY1.P$1 24.08,36.64 24.08,39.01 24.92,39.85 38.4,39.85 40.97,42.42 JP3.2
N$7
  Top 0.406: LED2.C R31.1
N$9
  Top 0.406: LED3.C R32.1
N$10
  Top 0.406: LED4.C R33.1
N$11
  Top 0.406: LED5.C R34.1
N$12
  Top 0.406: LED6.C R35.1
N$13
  Top 0.406: LED7.C R36.1
N$14
  Top 0.406: LED8.C R37.1
N$15
  Top 0.406: LED9.C R38.1
N$16
  Top 0.406: LED10.C R39.1
N$17
  Top 0.406: LED11.C R40.1
N$18
  Top 0.406: R12.2 78.79,13.41 79.63,14.25 79.63,17.22 80.09,17.68 JST-XH1.P$1
  Top 0.61: JST-XH1.P$1 82.83,17.68 84.28,19.13 84.28,21.33 JST-XH2.P$1
N$19
  Top 0.406: R13.2 78.33,10.52 80.85,13.03 80.85,14.78 81.15,15.09 82.7,15.09 JST-XH1.P$2
  Top 0.61: JST-XH1.P$2 82.85,15.18 85.42,17.75 85.42,22.68 JST-XH2.P$2
N$20  (via drill 0.6)
  Top 0.406: R14.2 v80.85,22.02
  Bottom 0.406: v80.85,22.02 80.85,21.49
  Bottom 0.61: JST-XH2.P$3 82.14,27.81 80.85,26.52 v80.85,22.02 80.85,21.49 80.85,20.27 80.85,19.96 80.85,13.87 81.99,12.73 82.75,12.73 JST-XH1.P$3
N$21  (via drill 0.6)
  Top 0.406: R15.2 v79.63,19.2
  Bottom 0.406: v79.63,19.2 79.63,18.67
  Bottom 0.61: JST-XH2.P$4 81.75,30.31 79.63,28.19 v79.63,19.2 79.63,18.67 79.63,18.14 79.63,17.91 79.63,11.66 81,10.29 82.68,10.29 JST-XH1.P$4
N$22  (via drill 0.6)
  Top 0.406: R16.2 v78.33,16.31
  Bottom 0.406: v78.33,16.31 78.33,16
  Bottom 0.61: JST-XH2.P$5 81.35,32.81 78.49,29.95 78.33,29.79 v78.33,16.31 78.33,16 78.33,15.85 78.33,15.39 78.33,10.21 80.62,7.92 82.55,7.92 JST-XH1.P$5
N$23  (via drill 0.6)
  Top 0.406: R17.2 70.15,9.86 71.25,8.76 77.04,8.76 v77.5,8.31
  Bottom 0.406: v77.5,8.31 78.14,7.66
  Bottom 0.61: JST-XH2.P$6 80.88,35.31 77.19,31.62 77.04,31.47 77.04,14.25 77.04,13.26 77.04,8.76 v77.5,8.31 78.14,7.66 80.54,5.26 82.71,5.26 JST-XH1.P$6
N$24
  Top 0.406: JP2.2 41.66,36.55 R6.2
N$25
  Top 0.406: U4.20 60.2,23.54 60.43,23.54 60.81,23.16 60.81,16.38 63.09,14.1 C6.1
N$26
  Top 0.61: F2.P$1 31.23,43.75 31.55,43.43 | 31.55,43.43 31.7,43.28 | 31.7,43.28 31.7,41.72 RLY1.P$8 | RLY1.P$6 36.76,43.17 36.42,43.51 31.93,43.51 31.7,43.28 | RLY1.P$10 24.06,42.8 24.76,43.51 31.47,43.51 31.55,43.43
N$27
  Top 0.406: JP2.1 39.98,34.01 37.41,36.58 36.81,36.58 RLY1.P$5
N$29  (via drill 0.5)
  Top 0.406: v37.34,26.29 37.34,26.67 37.87,27.2 37.87,28.37 R22.1 | U3.P$7 35.28,25.14 v36.12,24.31
  Bottom 0.406: v37.34,26.29 37.34,25.76 37.26,25.68 36.12,24.54 v36.12,24.31
N$30
  Top 0.406: U3.P$6 36.24,25.79 36.31,25.79 37.11,24.99 37.11,23.37 R23.1
N$32
  Top 0.406: U1.P$2 48.07,38.8 C1.2
OUTA
  Top 0.254: U3.P$1 38.73,24.54 39.47,24.54 39.88,24.94 U5.4 43.38,24.94 43.81,25.37 43.81,28.4 R20.2
OUTB
  Top 0.254: U5.5 40.94,24.03 40.77,23.85
  Top 0.305: U3.P$2 37.94,25.14 37.79,24.99 37.79,24.08 38.02,23.85 40.77,23.85 41.02,23.6 R21.2
PE  (via drill 0.4)
  Top 0.61: 23.09,46.56 F2.P$2 23.09,46.56 | 23.09,46.56 20.04,43.51 | 20.04,43.51 20.04,40.01 JP1.P$1 | 23.09,46.56 20.04,43.51 | 20.04,43.51 20.04,40.92 19.96,40.84 10.52,40.84 7.47,37.79 7.47,36.58 4.04,33.15 4.04,23.24 17.22,10.06 17.22,9.6 v17.3,9.52 | v17.3,15.85 19,15.85 JP1.P$13 | v17.3,41 15.55,41 JP1.P$2 | v17.3,34.75 19,34.75 JP1.P$3
  Top 3.81: JP1.P$2 8.84,37.19 5.49,33.83 5.49,20.12 8.15,17.45 8.15,16.99 7.47,17.68 7.47,33.07 10.36,35.97 11.51,35.97 6.4,30.86 6.4,19.89 6.1,20.19 5.87,20.19 13.49,12.57 18.36,12.57 11.05,12.57 4.65,18.97 4.65,32.99 3.81,32.16 3.81,28.96 | 3.81,28.96 3.81,15.85 9.07,10.59 20.04,10.59 20.04,14.78 9.6,14.78 9.83,14.55 9.45,14.93 9.37,14.93 9.6,14.71 9.68,14.71 9.98,14.4 9.98,14.33 9.14,15.16 6.25,18.06 6.25,32.08 6.32,32.16 6.4,32.23 9.68,35.51 9.75,35.51 8.46,36.8 8.46,38.02 8.61,38.18 16.92,38.18 15.09,40 8.23,40 3.96,35.74 3.81,35.59 | 3.81,35.59 3.81,28.96 | 3.81,28.96 3.81,35.59 | 3.81,35.59 14.55,35.74 | 14.55,35.74 14.55,37.95 20.04,37.95 20.04,35.89 20.04,35.74 14.55,35.74 | 14.55,35.74 JP1.P$2 | JP1.P$2 JP1.P$1 | 20.04,40.01 20.04,35.81 JP1.P$3 | JP1.P$14 JP1.P$13 JP1.P$15
  Bottom 0.61: JST-XH2.P$7 82.81,37.79 83.9,37.79 85.42,36.27 85.42,4.8 85.19,4.57 83.3,2.68 JST-XH1.P$7 81.25,1.14 19.51,1.14 19.43,1.22 17.3,3.35 v17.3,9.52
  Bottom 3.81: JP1.P$2 JP1.P$4 | JP1.P$3 9.97,35.8 6.17,32 6.17,19.89 11.28,14.78 17.91,12.8 16.92,11.81 12.12,11.81 12.12,13.72 11.05,14.78 19.96,14.78 | 19.96,14.78 20.04,14.86 | 20.04,14.86 9.75,14.86 9.68,14.93 9.68,13.33 9.83,13.18 8.53,13.18 7.01,14.71 7.92,16 7.31,16 7.47,16.15 7.47,32.84 7.39,32.92 7.39,33.07 7.47,33.15 7.24,33.15 5.56,31.47 5.56,30.02 10.74,35.2 10.74,35.36 6.1,35.36 7.85,37.11 9.52,37.11 10.52,38.1 17.91,38.1 20.04,35.97 20.04,35.81 20.04,40.08 19.96,40 8.15,40 4.04,35.89 3.81,35.66 3.81,15.85 8.08,11.58 9.07,10.59 20.04,10.59 20.04,14.86 | 20.04,14.86 19.96,14.78 | 19.96,14.78 14.54,14.78 | 14.54,14.78 JP1.P$14 | 14.54,14.78 14.54,10.61 JP1.P$16
REF1  (via drill 0.6)
  Top 0.406: JP8.6 56.59,36.55 57.15,37.11 61.04,37.11 61.49,36.65 | 61.49,36.65 61.49,34.92 IC1.2 | R30.1 71.93,39.32 71.7,39.55 68.12,39.55 67.74,39.17 67.59,39.01 v64.08,39.01 | 61.49,36.65 62.33,36.65 v62.64,36.96
  Bottom 0.406: 62.79,38.56 62.9,38.67 | v62.64,36.96 62.64,38.4 62.9,38.67 | 62.9,38.67 63.17,38.94 63.25,39.01 v64.08,39.01
REF2
  Top 0.406: JP8.4 53.34,37.11 54.25,38.02 54.33,38.1 63.17,38.1 64.06,37.21 | 64.01,34.95 IC1.3 64.06,37.21 | 64.06,37.21 64.95,38.1 67.21,38.1 69.32,38.1 R29.1
REF3
  Top 0.406: JP8.2 50.8,38.38 51.43,39.01 60.05,39.01 61.49,40.46 | 61.49,40.46 61.49,42.49 IC1.7 | R28.1 74.45,39.62 73.76,40.31 62.56,40.31 61.65,40.31 61.49,40.46
RESET  (via drill 0.5)
  Top 0.406: C5.2 R19.1 44.98,3.07 46.41,4.5 46.48,4.57 49.61,4.57 50.19,5.16 JP4.5 | U4.29 54.01,26.69 54.48,26.21 55.24,26.21 v55.24,21.49
  Top 0.61: SW1.P$2 SW1.P$3
  Bottom 0.406: SW1.P$3 60.41,3.89 52.58,3.89 51.71,4.75 JP4.5 53.42,6.86 53.42,7.47 58.52,12.57 58.6,12.57 58.6,14.93 58.06,15.47 56.62,15.47 56.62,17.45 56.62,17.91 56.39,18.14 55.7,18.14 55.24,18.59 v55.24,21.49
SCK  (via drill 0.5)
  Top 0.406: U4.17 58.52,21.14 58.6,21.07 v58.6,19.43
  Bottom 0.406: v58.6,19.43 57.61,18.44 57.61,16.69 57.99,16.31 59.28,16.31 59.59,16 59.59,12.19 58.67,11.28 54.25,6.86 JP4.3
VCC  (via drill 0.4)
  Top 0.406: 35.15,22.17 R23.2 32.54,22.48 v31.39,23.62 32.26,24.49 U3.P$8 | v29.26,19.28 28.73,19.28 28.57,19.13 | v28.35,18.36 28.35,18.74 28.57,18.97
  Top 0.61: R1.P$2 26.29,23.01 27.74,24.46 27.81,24.54 30.48,24.54 v31.39,23.62
  Top 2.54: JP1.P$9 25.26,23.2 R1.P$2 23.23,22.17 15.47,22.17 14.48,23.16 25.3,23.16 27.13,21.34 28.35,21.34 28.57,21.11 28.57,19.13 28.57,18.97 14.48,18.97 14.48,22.1 14.63,22.25 14.78,22.25 16.61,20.42 26.67,20.42 27.05,20.04 27.74,20.04 28.65,19.13 28.65,22.48 JP1.P$11
  Bottom 0.61: v31.39,23.62 30.56,24.46 30.48,24.54 27.81,24.54 26.9,23.62 26.9,23.16 26.67,22.94
  Bottom 2.54: JP1.P$12 20.12,20.65 18.97,21.79 18.74,21.79 18.44,21.49 17.68,21.49 19.05,20.12 26.75,20.12 25.6,18.97 14.48,18.97 14.48,23.16 18.67,18.97 28.5,18.97 28.57,19.05 | 28.57,19.05 28.57,18.97 28.57,19.05 | 28.57,19.05 28.65,19.13 28.65,22.48 28.57,22.48 26.36,22.48 26.21,22.33 26.21,22.25 25.26,23.2 JP1.P$10 JP1.P$9 21.08,22.17 R1.P$2
VCC/2  (via drill 0.4)
  Top 0.406: U3.P$5 32.08,26.44 v31.39,27.13 32.69,28.42 R22.2 | v28.35,32.31 28.35,31.85 28.5,31.7 | 28.65,31.7 28.96,31.7 v29.26,31.39
  Top 0.61: R5.1 44.12,38.25 | 44.12,38.25 R6.1 | 44.12,38.25 32.16,38.25 31.68,37.78 RLY1.P$3 31.68,35.64 v28.35,32.31 | v31.39,27.13 30.48,26.21 27.81,26.21 26.59,27.43
  Top 2.54: JP1.P$7 23.24,28.65 23.62,28.27 28.65,28.27 28.65,31.7 | 28.65,31.7 26.67,29.72 18.21,29.72 19.74,28.19 25.91,28.19 25.07,27.36 14.48,27.36 14.48,31.7 28.5,31.7 28.65,31.7 | 28.65,31.7 28.57,31.62 14.48,31.62 18.7,27.4 25.11,27.4 R2.P$1
  Bottom 0.61: R2.P$1 26.29,27.74 27.81,26.21 30.48,26.21 v31.39,27.13
  Bottom 2.54: R2.P$1 23.08,28.57 JP1.P$5 | JP1.P$5 JP1.P$7 | JP1.P$8 JP1.P$6 14.55,27.74 14.63,27.66 14.48,27.66 14.48,31.7 25.22,31.7 28.65,31.7 28.65,29.72 28.12,29.72 27.66,30.17 16.54,30.17 15.93,29.57 15.93,28.8 14.48,27.36 25.07,27.36 25.98,28.27 15.16,28.27 14.93,28.5 24.38,28.5 24.76,28.88 28.65,28.27 JP1.P$5
XTAL1  (via drill 0.5, 0.6)
  Top 0.406: XT1.P$3 56.06,9.39 54.86,10.59 54.56,10.9 51.97,10.9 51.36,11.51 C8.2 51.36,14.1 52.73,15.47 R24.2 51.05,15.47 50.9,15.47 v50.14,14.71 | U4.7 47.62,21.95 47.09,21.41 46.94,21.26 v46.94,20.95
  Bottom 0.406: v46.94,20.95 46.94,18.21 46.94,17.83 50.06,14.71 v50.14,14.71
XTAL2  (via drill 0.5)
  Top 0.406: R24.1 56.26,15.47 XT1.P$1 | R24.1 58.37,13.39 C7.2 | v54.86,17.07 54.86,16.89 R24.1 | U4.8 48.43,21.15 v48.23,20.95
  Bottom 0.406: v54.86,17.07 54.86,15.39 54.33,14.86 51.82,14.86 51.59,14.86 51.21,15.24 48.23,18.21 48.23,18.44 v48.23,20.95

### Text on the board
tPlace: OUT - | OUT - | OUT + | OUT + | IN + | IN + | IN - | IN - | GND CTS +5V TXO RXI DTR
tNames: SCL SDA +5V GND | SCL SDA +5V GND | BBAUV PWR MONITORING BOARD ver 0.9A / Hoang The Huan / Jeremias Wong / / 30A CONT | 50A MAX